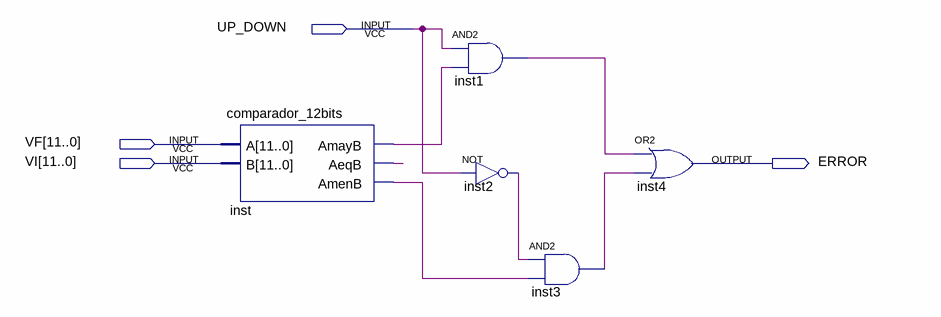
[diagram p0: schematic sheet]
// Quartus schematic UC_detector_error.bdf as structural Verilog: 5 symbols, 4 pins
module UC_detector_error (
  input  UP_DOWN,
  input  [11:0] VF,
  input  [11:0] VI,
  output ERROR
);

  wire inst1_out, inst2_out, inst3_out, inst_aeqb, inst_amayb, inst_amenb;

  comparador_12bits inst (.A(VF), .B(VI), .AmayB(inst_amayb), .AeqB(inst_aeqb), .AmenB(inst_amenb));
  and inst1 (inst1_out, UP_DOWN, inst_amayb);
  not inst2 (inst2_out, UP_DOWN);
  and inst3 (inst3_out, inst2_out, inst_amenb);
  or inst4 (ERROR, inst1_out, inst3_out);
endmodule
